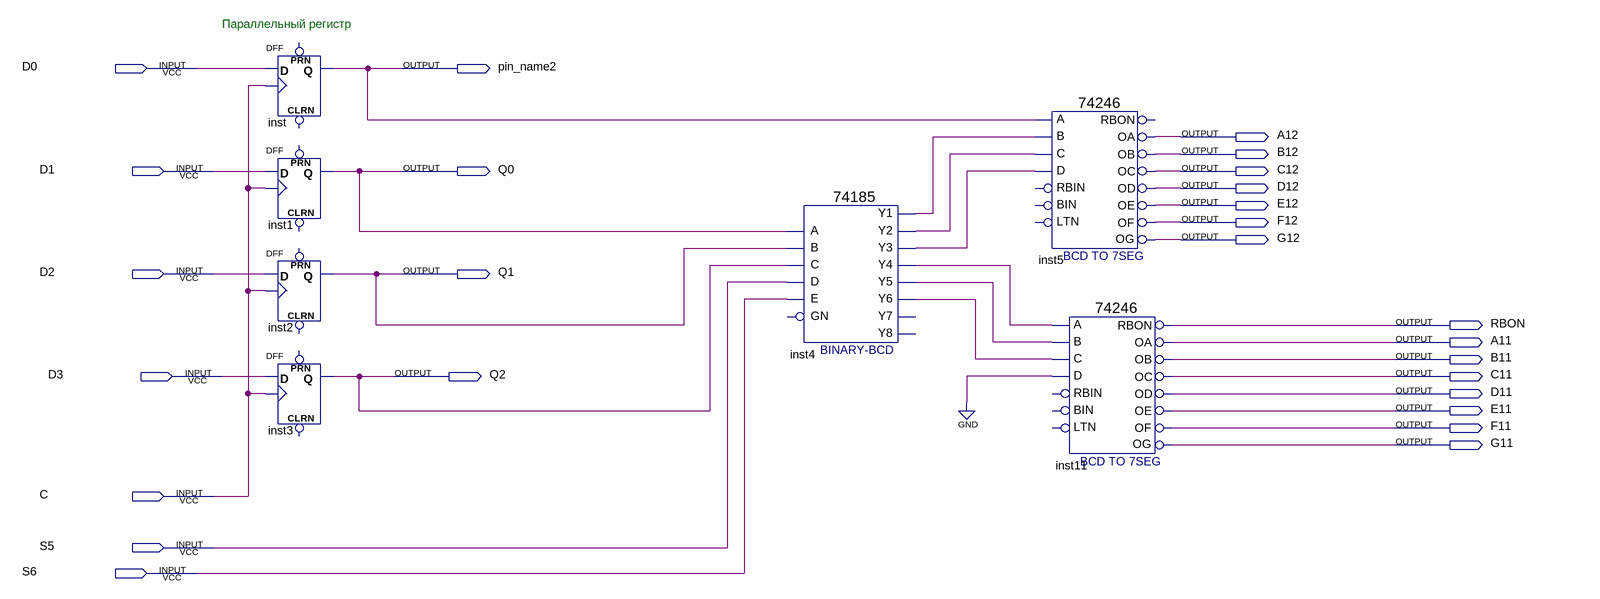
[diagram p0: schematic sheet]
// Quartus schematic Registers.bdf as structural Verilog: 7 symbols, 26 pins
module Registers (
  input  D0,
  input  D1,
  input  D2,
  input  D3,
  input  C,
  input  S5,
  input  S6,
  output pin_name2,
  output A12,
  output B12,
  output Q0,
  output C12,
  output D12,
  output E12,
  output F12,
  output G12,
  output Q1,
  output RBON,
  output A11,
  output B11,
  output Q2,
  output C11,
  output D11,
  output E11,
  output F11,
  output G11
);

  wire inst4_y1, inst4_y2, inst4_y3, inst4_y4, inst4_y5, inst4_y6;

  DFF inst (.CLK(C), .D(D0), .Q(pin_name2));  // open: CLRN, PRN
  DFF inst1 (.CLK(C), .D(D1), .Q(Q0));  // open: CLRN, PRN
  DFF inst2 (.CLK(C), .D(D2), .Q(Q1));  // open: CLRN, PRN
  DFF inst3 (.CLK(C), .D(D3), .Q(Q2));  // open: CLRN, PRN
  \74185  inst4 (
    .A(Q0), .B(Q1), .D(S5), .C(Q2), .E(S6), .Y1(inst4_y1), .Y3(inst4_y3), .Y2(inst4_y2), .Y5(inst4_y5),
    .Y4(inst4_y4), .Y6(inst4_y6));  // open: GN, Y8, Y7
  \74246  inst5 (
    .B(inst4_y1), .A(pin_name2), .D(inst4_y3), .C(inst4_y2), .OD(D12), .OC(C12), .OB(B12), .OE(E12),
    .OF(F12), .OA(A12), .OG(G12));  // open: RBIN, LTN, BIN, RBON
  \74246  inst11 (
    .B(inst4_y5), .A(inst4_y4), .D(1'b0), .C(inst4_y6), .OD(D11), .RBON(RBON), .OC(C11), .OB(B11), .OE(E11),
    .OF(F11), .OA(A11), .OG(G11));  // open: RBIN, LTN, BIN

  // Notes on the sheet:
  //   Параллельный регистр
endmodule
